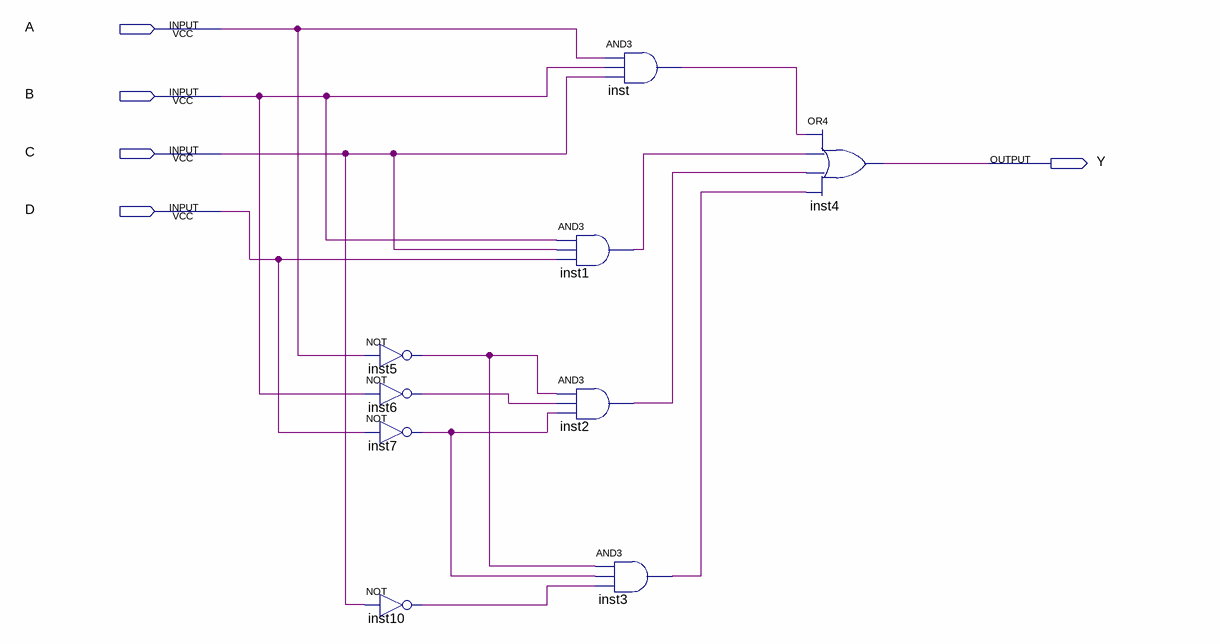
[diagram p0: schematic sheet]
// Quartus schematic pr1timfad.bdf as structural Verilog: 9 symbols, 5 pins
module pr1timfad (
  input  A,
  input  B,
  input  C,
  input  D,
  output Y
);

  wire inst1_out, inst2_out, inst3_out, inst5_out, inst6_out, inst7_out, inst10_out, inst_out;

  not inst5 (inst5_out, A);
  not inst6 (inst6_out, B);
  not inst7 (inst7_out, D);
  not inst10 (inst10_out, C);
  and inst1 (inst1_out, B, C, D);
  and inst2 (inst2_out, inst5_out, inst6_out, inst7_out);
  and inst (inst_out, A, B, C);
  and inst3 (inst3_out, inst5_out, inst7_out, inst10_out);
  or inst4 (Y, inst_out, inst1_out, inst2_out, inst3_out);
endmodule
